# Altium schematic sheet _microcontroller.SchDoc
size Tabloid
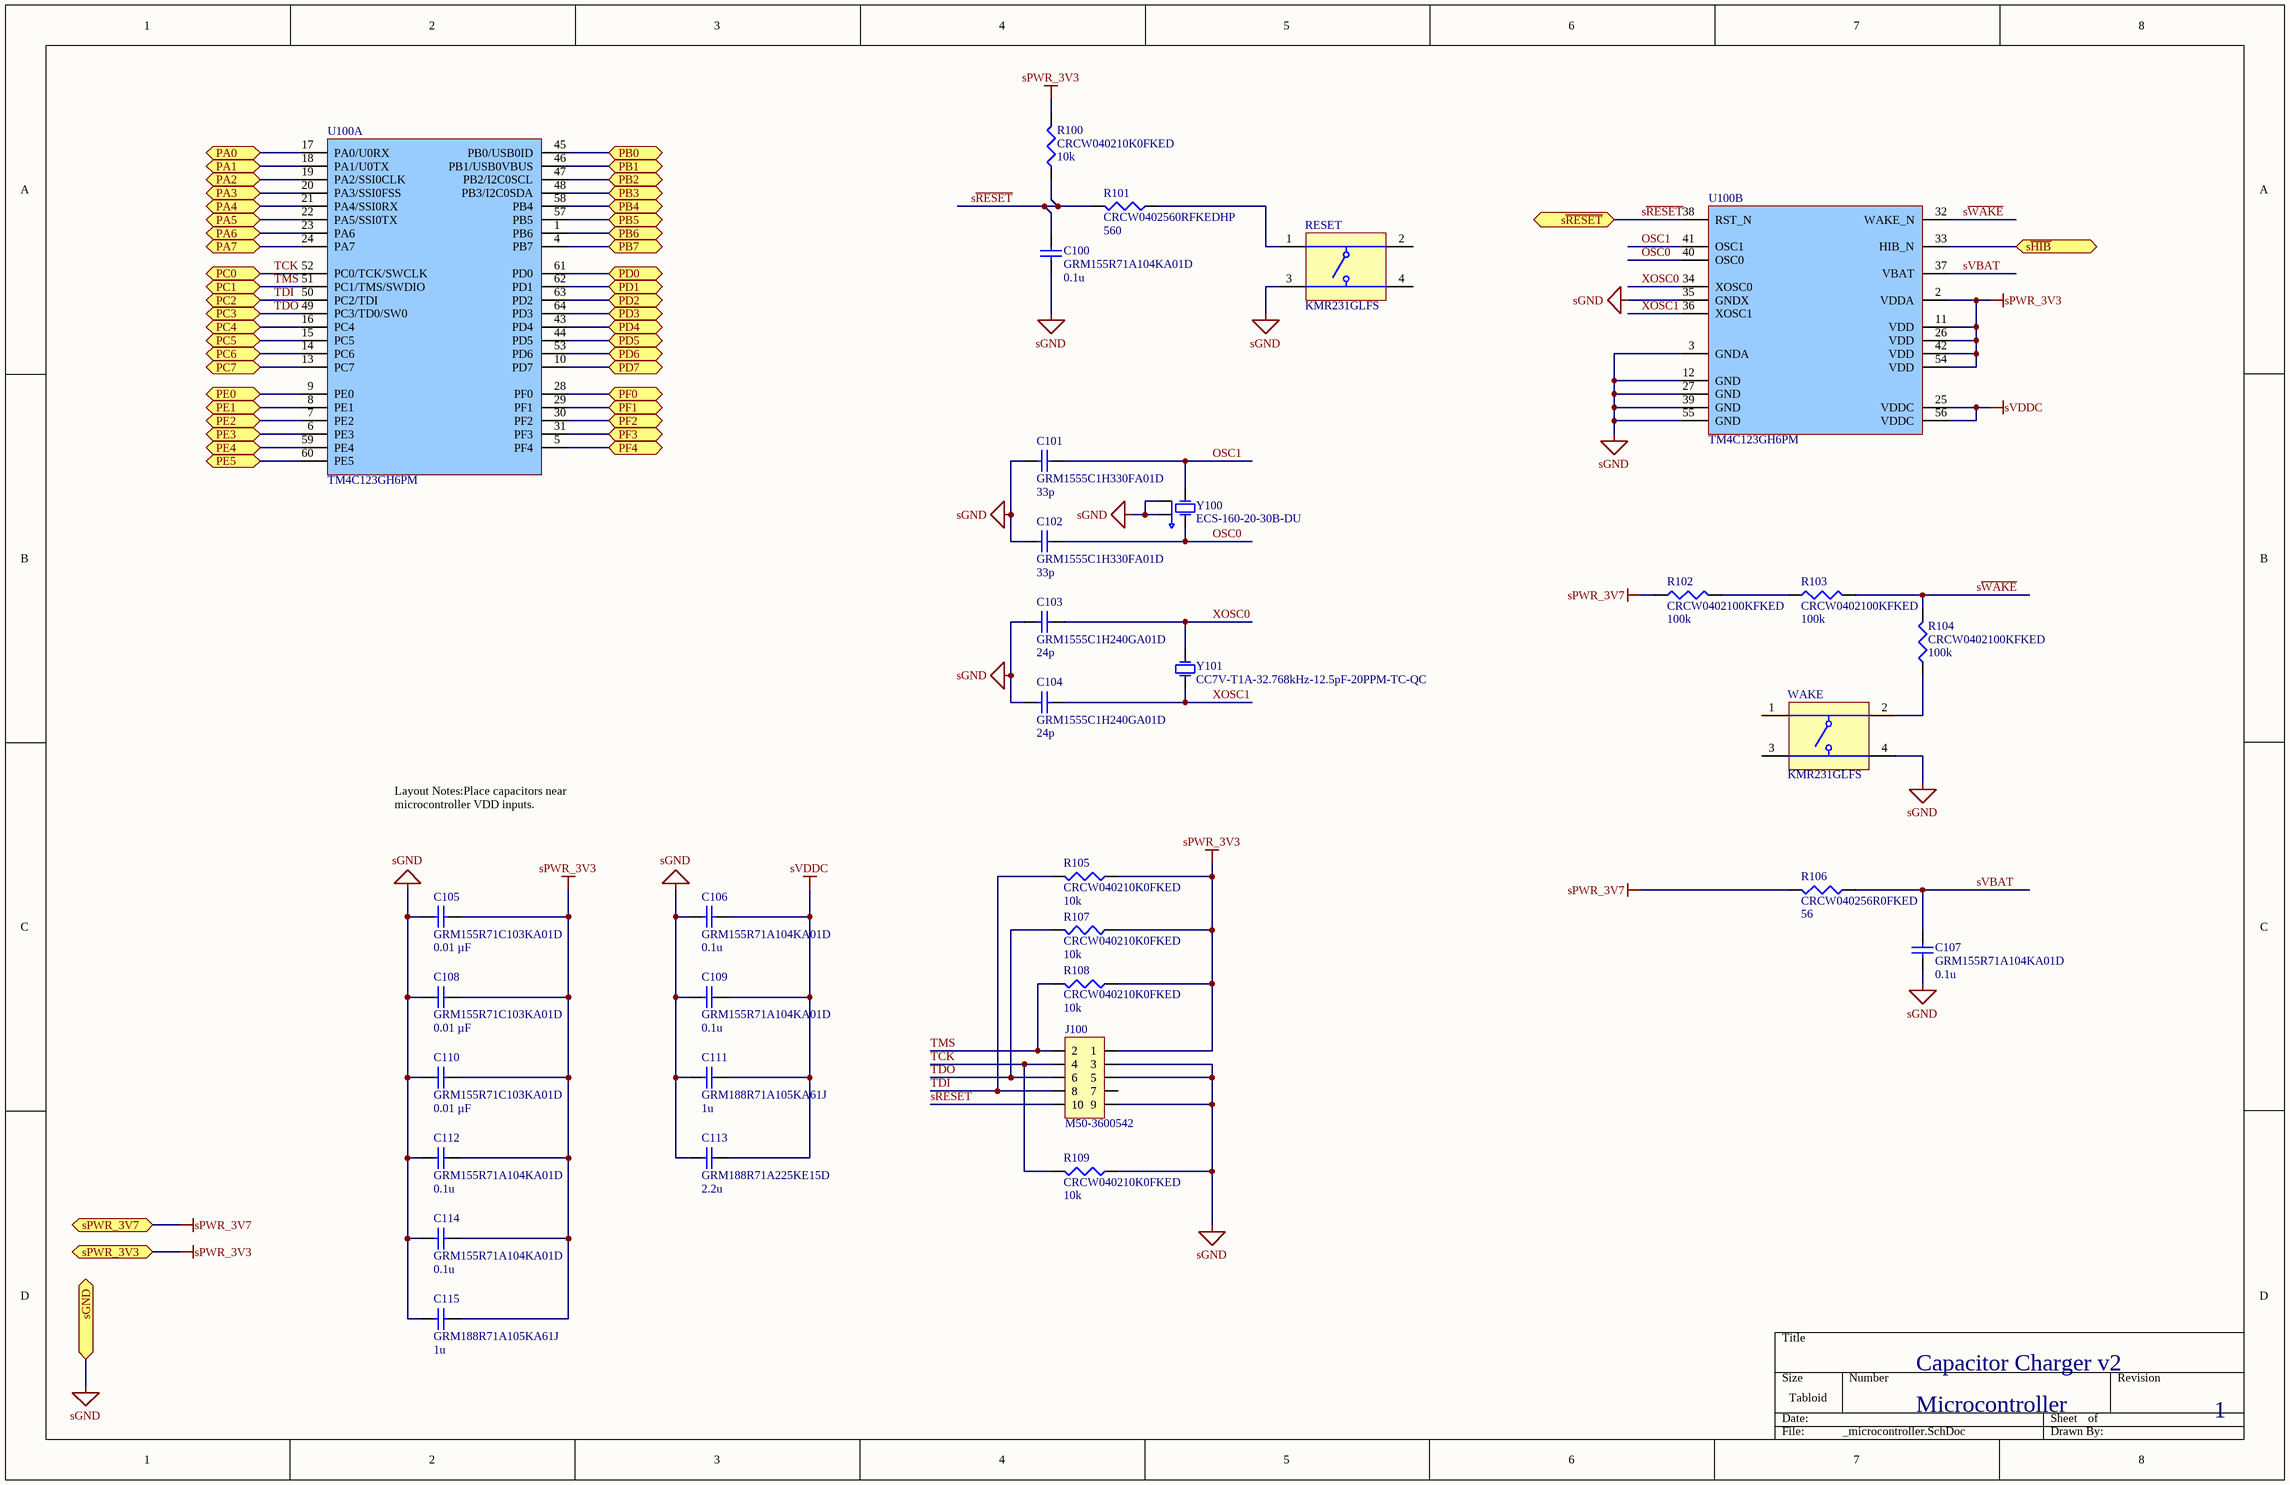
[diagram p0: _microcontroller.SchDoc]

## Parts
C100  GRM155R71A104KA01D  value 0.1u  [0402]
C101  GRM1555C1H330FA01D  value 33p  [0402]
C102  GRM1555C1H330FA01D  value 33p  [0402]
C103  GRM1555C1H240GA01D  value 24p  [0402]
C104  GRM1555C1H240GA01D  value 24p  [0402]
C105  GRM155R71C103KA01D  value 0.01 µF  [0402]
C106  GRM155R71A104KA01D  value 0.1u  [0402]
C107  GRM155R71A104KA01D  value 0.1u  [0402]
C108  GRM155R71C103KA01D  value 0.01 µF  [0402]
C109  GRM155R71A104KA01D  value 0.1u  [0402]
C110  GRM155R71C103KA01D  value 0.01 µF  [0402]
C111  GRM188R71A105KA61J  value 1u  [0603]
C112  GRM155R71A104KA01D  value 0.1u  [0402]
C113  GRM188R71A225KE15D  value 2.2u  [0603]
C114  GRM155R71A104KA01D  value 0.1u  [0402]
C115  GRM188R71A105KA61J  value 1u  [0603]
J100  M50-3600542  [M50-3600542]
R100  CRCW040210K0FKED  value 10k  [0402]
R101  CRCW0402560RFKEDHP  value 560  [0402]
R102  CRCW0402100KFKED  value 100k  [0402]
R103  CRCW0402100KFKED  value 100k  [0402]
R104  CRCW0402100KFKED  value 100k  [0402]
R105  CRCW040210K0FKED  value 10k  [0402]
R106  CRCW040256R0FKED  value 56  [0402]
R107  CRCW040210K0FKED  value 10k  [0402]
R108  CRCW040210K0FKED  value 10k  [0402]
R109  CRCW040210K0FKED  value 10k  [0402]
RESET  KMR231GLFS  [CKCP-KMR231GLFS]
U100  TM4C123GH6PM  [QFP50P1200X1200X160-64N]  (parts A,B of 2)
WAKE  KMR231GLFS  [CKCP-KMR231GLFS]
Y100  ECS-160-20-30B-DU  [ECX-53B]
Y101  CC7V-T1A-32.768kHz-12.5pF-20PPM-TC-QC  [CC7V-T1A]

## Ports
PA0, PA1, PA2, PA3, PA4, PA5, PA6, PA7, PB0, PB1, PB2, PB3, PB4, PB5, PB6, PB7, PC0, PC1, PC2, PC3, PC4, PC5, PC6, PC7, PD0, PD1, PD2, PD3, PD4, PD5, PD6, PD7, PE0, PE1, PE2, PE3, PE4, PE5, PF0, PF1, PF2, PF3, PF4, sGND, sPWR_3V3, sPWR_3V7, s~{HIB}, s~{RESET}

## Nets
sGND: C100.2 C101.1 C102.1 C103.1 C104.1 C105.2 C106.2 C107.2 C108.2 C109.2 C110.2 C111.2 C112.2 C113.2 C114.2 C115.2 J100.3 J100.5 J100.9 R109.1 RESET.3 U100.3(GNDA) U100.12(GND) U100.27(GND) U100.35(GNDX) U100.39(GND) U100.55(GND) WAKE.4 Y100.2 Y100.4 ; port sGND
sPWR_3V3: C105.1 C108.1 C110.1 C112.1 C114.1 C115.1 J100.1 R100.2 R105.1 R107.1 R108.1 U100.2(VDDA) U100.11(VDD) U100.26(VDD) U100.42(VDD) U100.54(VDD) ; port sPWR_3V3
sPWR_3V7: R102.1 R106.2 ; port sPWR_3V7
sVDDC: C106.1 C109.1 C111.1 C113.1 U100.25(VDDC) U100.56(VDDC)
OSC0: C102.2 U100.40(OSC0) Y100.3
OSC1: C101.2 U100.41(OSC1) Y100.1
PA0: U100.17(PA0/U0RX) ; port PA0
PA1: U100.18(PA1/U0TX) ; port PA1
PA2: U100.19(PA2/SSI0CLK) ; port PA2
PA3: U100.20(PA3/SSI0FSS) ; port PA3
PA4: U100.21(PA4/SSI0RX) ; port PA4
PA5: U100.22(PA5/SSI0TX) ; port PA5
PA6: U100.23(PA6) ; port PA6
PA7: U100.24(PA7) ; port PA7
PB0: U100.45(PB0/USB0ID) ; port PB0
PB1: U100.46(PB1/USB0VBUS) ; port PB1
PB2: U100.47(PB2/I2C0SCL) ; port PB2
PB3: U100.48(PB3/I2C0SDA) ; port PB3
PB4: U100.58(PB4) ; port PB4
PB5: U100.57(PB5) ; port PB5
PB6: U100.1(PB6) ; port PB6
PB7: U100.4(PB7) ; port PB7
PC4: U100.16(PC4) ; port PC4
PC5: U100.15(PC5) ; port PC5
PC6: U100.14(PC6) ; port PC6
PC7: U100.13(PC7) ; port PC7
PD0: U100.61(PD0) ; port PD0
PD1: U100.62(PD1) ; port PD1
PD2: U100.63(PD2) ; port PD2
PD3: U100.64(PD3) ; port PD3
PD4: U100.43(PD4) ; port PD4
PD5: U100.44(PD5) ; port PD5
PD6: U100.53(PD6) ; port PD6
PD7: U100.10(PD7) ; port PD7
PE0: U100.9(PE0) ; port PE0
PE1: U100.8(PE1) ; port PE1
PE2: U100.7(PE2) ; port PE2
PE3: U100.6(PE3) ; port PE3
PE4: U100.59(PE4) ; port PE4
PE5: U100.60(PE5) ; port PE5
PF0: U100.28(PF0) ; port PF0
PF1: U100.29(PF1) ; port PF1
PF2: U100.30(PF2) ; port PF2
PF3: U100.31(PF3) ; port PF3
PF4: U100.5(PF4) ; port PF4
s~{HIB}: U100.33(HIB_N) ; port s~{HIB}
s~{RESET}: C100.1 J100.10 R100.1 R101.2 U100.38(RST_N) ; port s~{RESET}
sVBAT: C107.1 R106.1 U100.37(VBAT)
s~{WAKE}: R103.2 R104.2 U100.32(WAKE_N)
TCK: J100.4 R109.2 U100.52(PC0/TCK/SWCLK) ; port PC0
TDI: J100.8 R105.2 U100.50(PC2/TDI) ; port PC2
TDO: J100.6 R107.2 U100.49(PC3/TD0/SW0) ; port PC3
TMS: J100.2 R108.2 U100.51(PC1/TMS/SWDIO) ; port PC1
XOSC0: C103.2 U100.34(XOSC0) Y101.1
XOSC1: C104.2 U100.36(XOSC1) Y101.2
NetR101_1: R101.1 RESET.1
NetR102_2: R102.2 R103.1
NetR104_1: R104.1 WAKE.2

Not connected (* = marked no-connect by the designer): J100 7; RESET 2 4; WAKE 1 3

## Notes on the sheet
- Layout Notes:Place capacitors near microcontroller VDD inputs.
- Capacitor Charger v2
- Microcontroller
- 1

## Library data of the parts
C100 C106 C107 C109 C112 C114 = GRM155R71AxxxKdddd: -55-125C, 1005, 10V, X7R, ±10%
C101-C104 = Cap Semi: Capacitor (Semiconductor SIM Model); Published: 8-Jun-2000; LatestRevisionDate: 29-May-2009; LatestRevisionNote: IPC-7351 Footprint Added.; PackageReference: C1206; Publisher: Altium Limited; PackageDescription: Chip Capacitor
C105 C108 C110 = Cap: Cap, 0.01 µF, 16 V, X7R; Published: 8-Jun-2000; LatestRevisionDate: 17-Jul-2002; LatestRevisionNote: Re-released for DXP Platform.; PackageReference: RAD-0.3; Publisher: Altium Limited; PackageDescription: Radial Cap, Thru-Hole; 2 Leads; 0.3 in Pin Spacing
C111 C113 C115 = GRM188R71AxxxKdddd: -55-125C, 1608, 10V, X7R, ±10%
R100-R109 = CRCW0402xxxxFKED: 0.125W, -55-155C, 1005, 50V, ±1%
RESET WAKE = CMP-2000-06516-1: Switch Tactile, SPST, 50 mA, 32 V, -40 to 85 degC, 4-Pin SMD, RoHS, Tape and Reel; Manufacturer: C&K Components; Mechanical Life: 150000Cycles; Switch Configuration: N.O.; Actuator Style: Button; Ground Terminal: Yes; Maximum DC Voltage Rating: 32V; Minimum Insulation Resistance: >=1000MOhm; Dielectric Strength: >=250Vrms; Operating Force: 3N; Illumination Type: N/R; Body Orientation: Straight; Contact Rating @ Voltage: 1A; Actuator Length: 0.5mm; Operating Temperature: -40to85C; Electrical Life: N/A; Housing Material: N/A; ECCN: EAR99; Pole Throw Configuration: SPST; Contact Plating: Silver; Dimension: 2.8x4.6x1.9mm; Type: Micro-Miniature; Product Weight: N/A; Package Description: 4-Pin Surface Mount Device, Body 4.6 x 2.8 mm; Actuator Color: N/A; HTS: 8536501199; Mounting Technology: SurfaceMount; Mounting: SurfaceMount,GullWing; Seal Location: N/A; Base Material: N/A; Family: KMR2; Part No: KMR231GLFS; Datasheet Version: 06/2016; Contact Material: Silver; Package Reference: KMR231GLFS; Manufacturer URL: http://www.ckswitches.com/; Maximum AC Voltage Rating: N/A; Datasheet URL: http://www.ck-components.com/media/1479/kmr2.pdf; RoHS: Yes; Seal Description: N/A; Packaging: TapeandReel; Supplier: C&KComponents
U100 = TM4C123GH6PM: Tiva TM4C123GH6PM Microcontroller
Y100 = ECS-160-20-30B-DU: Crystal, 16.000MHz, 20pF, 100ppm, -55 to 125 C, 60 Ω
Y101 = CC7V-T1A: Crystals 32.768 kHz 12.5 pF +/-20 PPM -55/+125C